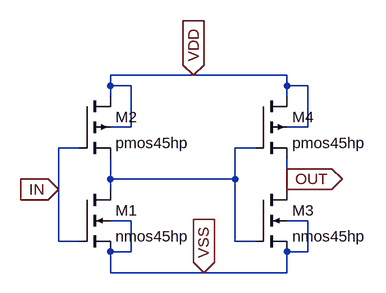
[diagram p0: schematic BUF.asc]
BUF.asc, the LTspice schematic file:
Version 4.1
SHEET 1 880 680
WIRE 320 0 192 0
WIRE 464 0 320 0
WIRE 192 16 192 0
WIRE 224 16 192 16
WIRE 464 16 464 0
WIRE 496 16 464 16
WIRE 192 32 192 16
WIRE 464 32 464 16
WIRE 224 80 224 16
WIRE 224 80 192 80
WIRE 496 80 496 16
WIRE 496 80 464 80
WIRE 144 112 112 112
WIRE 416 112 384 112
WIRE 192 160 192 128
WIRE 384 160 384 112
WIRE 384 160 192 160
WIRE 464 160 464 128
WIRE 112 176 112 112
WIRE 192 176 192 160
WIRE 464 176 464 160
WIRE 224 224 192 224
WIRE 496 224 464 224
WIRE 112 256 112 176
WIRE 144 256 112 256
WIRE 384 256 384 160
WIRE 416 256 384 256
WIRE 224 272 224 224
WIRE 224 272 192 272
WIRE 496 272 496 224
WIRE 496 272 464 272
WIRE 192 304 192 272
WIRE 336 304 192 304
WIRE 464 304 464 272
WIRE 464 304 336 304
FLAG 112 176 IN
IOPIN 112 176 In
FLAG 464 160 OUT
IOPIN 464 160 Out
FLAG 320 0 VDD
IOPIN 320 0 In
FLAG 336 304 VSS
IOPIN 336 304 In
SYMBOL nmos4 144 176 R0
SYMATTR InstName M1
SYMATTR Value nmos45hp
SYMATTR Value2 l=100n w=200n
SYMBOL pmos4 144 32 R0
SYMATTR InstName M2
SYMATTR Value pmos45hp
SYMATTR Value2 l=100n w=300n
SYMBOL nmos4 416 176 R0
SYMATTR InstName M3
SYMATTR Value nmos45hp
SYMATTR Value2 l=100n w=200n
SYMBOL pmos4 416 32 R0
SYMATTR InstName M4
SYMATTR Value pmos45hp
SYMATTR Value2 l=100n w=300n

The netlist it stands for:
* BUF.asc
M1 N001 IN VSS VSS nmos45hp l=100n w=200n
M2 VDD IN N001 VDD pmos45hp l=100n w=300n
M3 OUT N001 VSS VSS nmos45hp l=100n w=200n
M4 VDD N001 OUT VDD pmos45hp l=100n w=300n
.model NMOS NMOS
.model PMOS PMOS
.lib standard.mos
.backanno
.end